# EAGLE board Mem Switch V1.1 (EAGLE 9.6.2), part 1 of 2
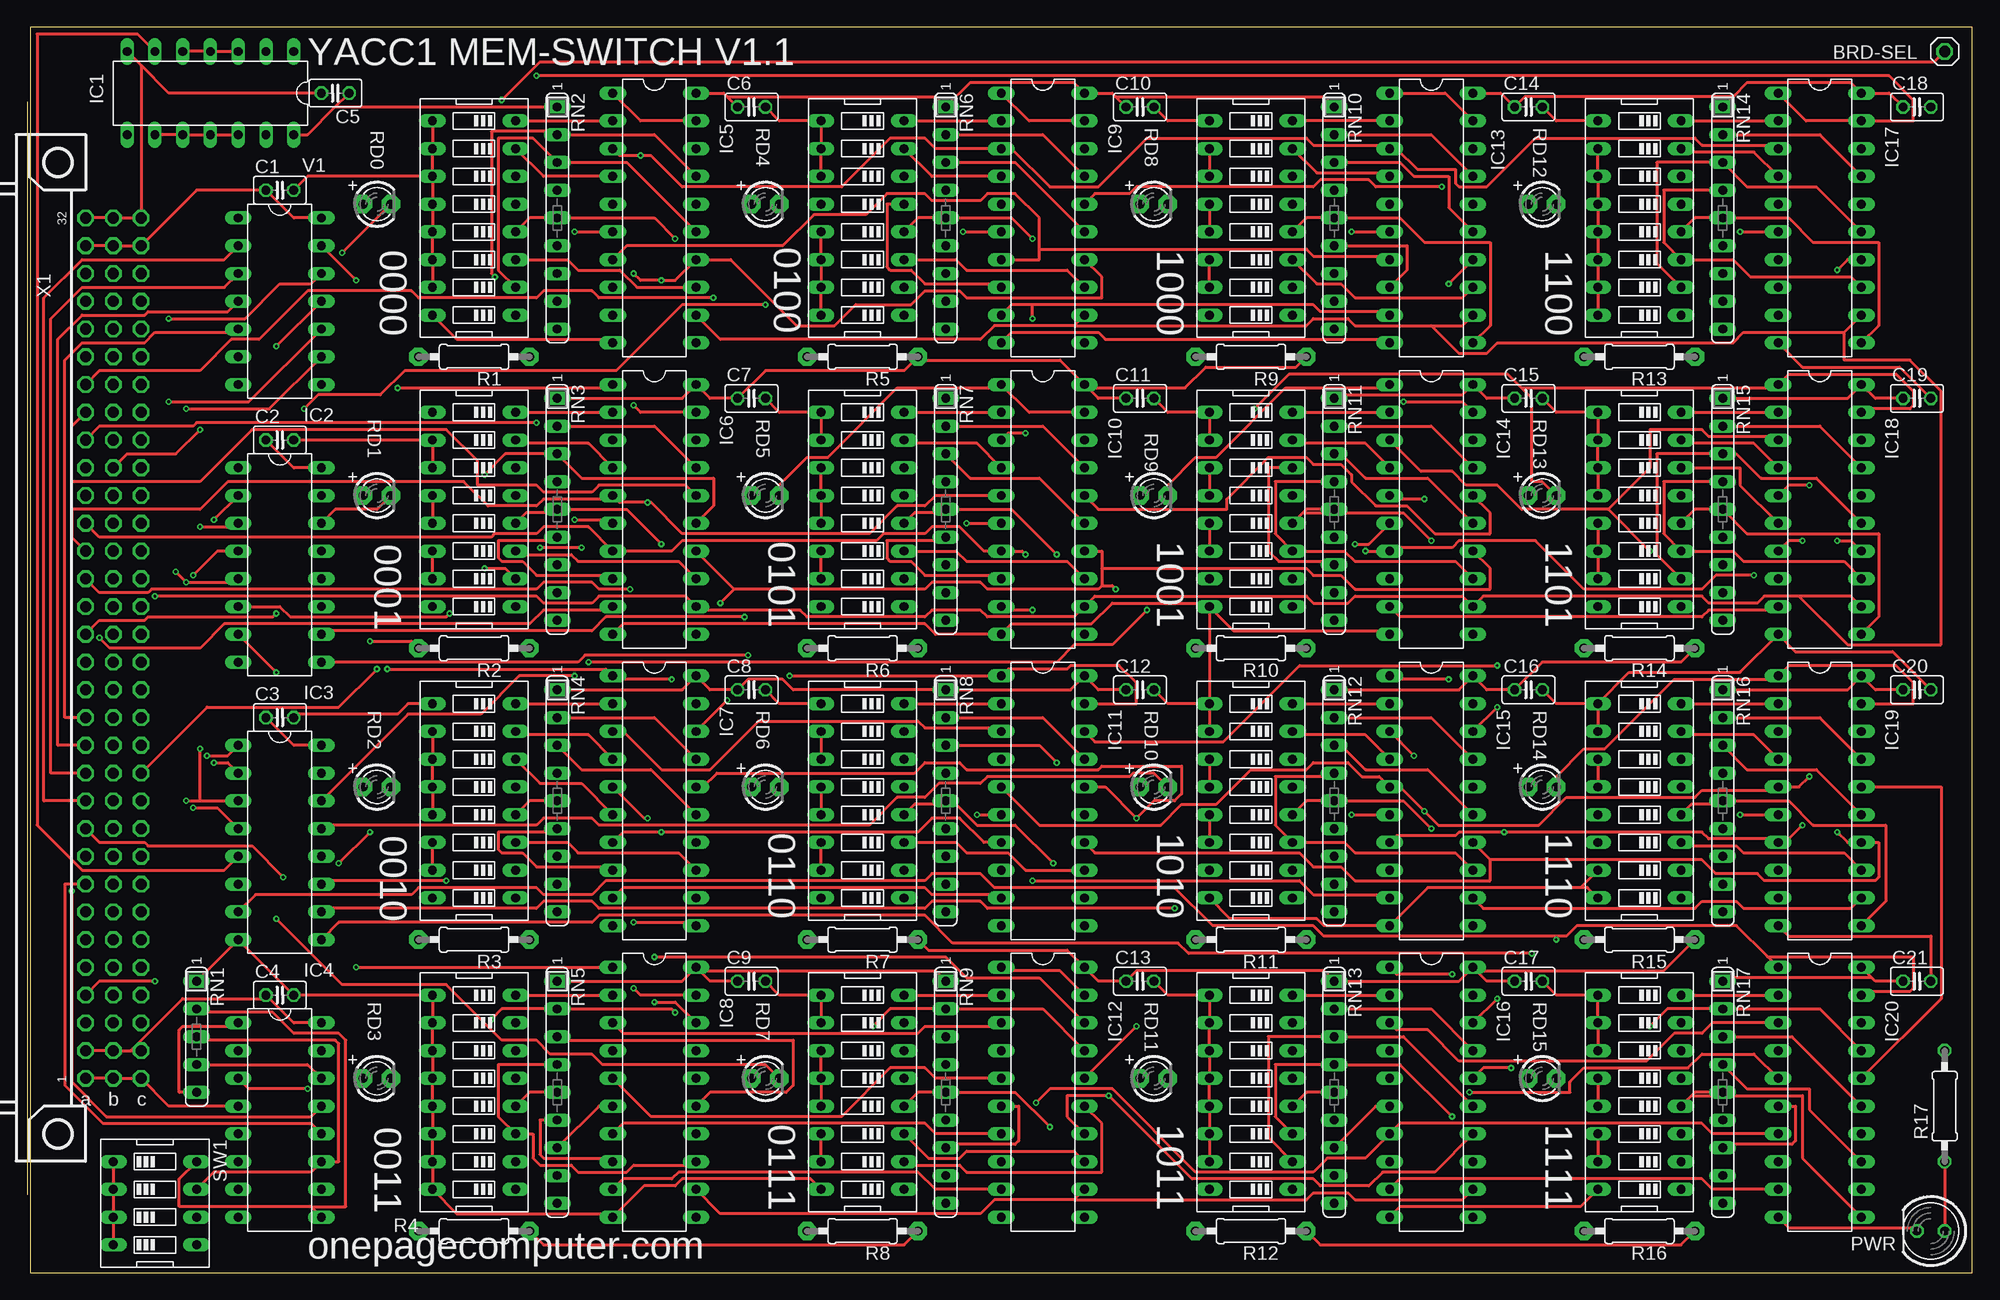
[diagram p3: board, top side]
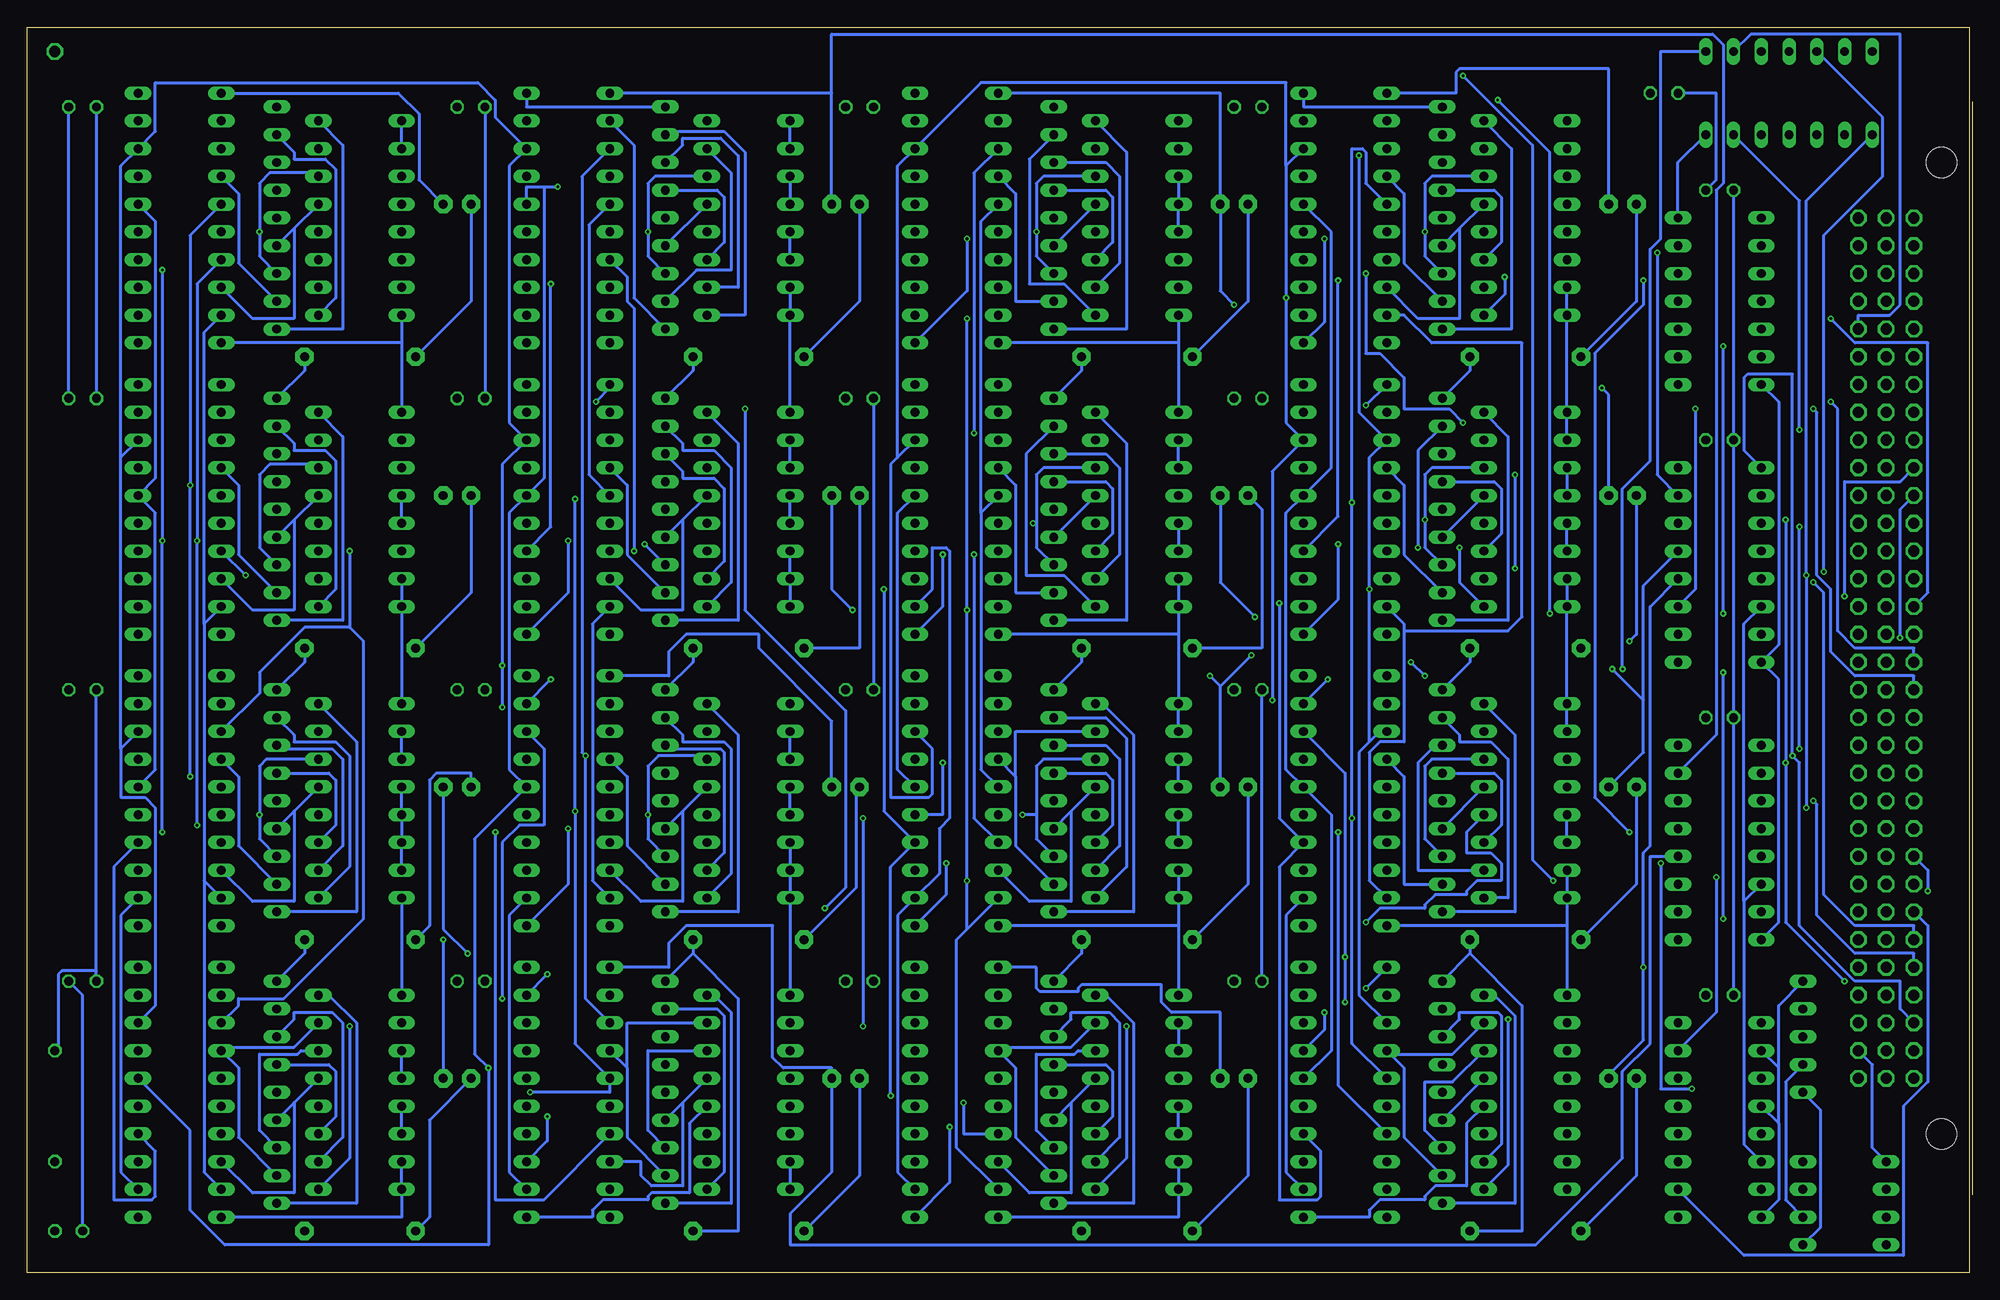
[diagram p4: board, bottom side, seen from below]

Size 177.78 x 113.97 mm. Coordinates in mm from the lower left corner, seen from the top.
Outline: 0,0 177.78,0 177.78,113.97 0,113.97 0,0
Copper layers (1*16): Top 0.035559375mm / dielectric 1.6mm / Bottom 0.035559375mm
Design rules "oshpark-2layer-auto-routing": minimum track width 10mil, minimum drill 10mil, track to track 10mil, track to pad 8mil, pad to pad 8mil, via to via 8mil, smd to smd 6mil, copper to edge 15mil, drill to drill 6mil, minimum pad ring 6mil, minimum via ring 6mil, stop-mask expansion 2.5mil, vias tented up to drill 0mil, thermal gap 10mil
Net classes: 1 GND: width 1 mm; 2 5V: width 1 mm

## Footprints (pad centres in the part's own frame; a part is rotated, then mirrored left to right if it is on the bottom)
EDG-08 = drill 0.813 long: 1 -8.89,-3.81; 2 -6.35,-3.81; 3 -3.81,-3.81; 4 -1.27,-3.81; 5 1.27,-3.81; 6 3.81,-3.81; 7 6.35,-3.81; 8 8.89,-3.81; 9 8.89,3.81; 10 6.35,3.81; 11 3.81,3.81; 12 1.27,3.81; 13 -1.27,3.81; 14 -3.81,3.81; 15 -6.35,3.81; 16 -8.89,3.81
1X01 = drill 1.016 octagon: 1 0,0
C025-025X050 = drill 0.813 octagon: 1 -1.27,0; 2 1.27,0
DIL14 = drill 0.813 long: 1 -7.62,-3.81; 2 -5.08,-3.81; 3 -2.54,-3.81; 4 0,-3.81; 5 2.54,-3.81; 6 5.08,-3.81; 7 7.62,-3.81; 8 7.62,3.81; 9 5.08,3.81; 10 2.54,3.81; 11 0,3.81; 12 -2.54,3.81; 13 -5.08,3.81; 14 -7.62,3.81
DIL16 = drill 0.813 long: 1 -8.89,-3.81; 2 -6.35,-3.81; 3 -3.81,-3.81; 4 -1.27,-3.81; 5 1.27,-3.81; 6 3.81,-3.81; 7 6.35,-3.81; 8 8.89,-3.81; 9 8.89,3.81; 10 6.35,3.81; 11 3.81,3.81; 12 1.27,3.81; 13 -1.27,3.81; 14 -3.81,3.81; 15 -6.35,3.81; 16 -8.89,3.81
DIL20 = drill 0.813 long: 1 -11.43,-3.81; 2 -8.89,-3.81; 3 -6.35,-3.81; 4 -3.81,-3.81; 5 -1.27,-3.81; 6 1.27,-3.81; 7 3.81,-3.81; 8 6.35,-3.81; 9 8.89,-3.81; 10 11.43,-3.81; 11 11.43,3.81; 12 8.89,3.81; 13 6.35,3.81; 14 3.81,3.81; 15 1.27,3.81; 16 -1.27,3.81; 17 -3.81,3.81; 18 -6.35,3.81; 19 -8.89,3.81; 20 -11.43,3.81
LED5MM = drill 0.813 octagon: A -1.27,0; K 1.27,0
0207/10 = drill 0.813 pad 1.676 octagon: 1 -5.08,0; 2 5.08,0
0207/10' = drill 0.813 octagon: 1 -5.08,0; 2 5.08,0
LED3MM = drill 0.813 pad 1.676 octagon: A -1.27,0; K 1.27,0
SIL5 = drill 0.813 long: 1 -5.08,0; 2 -2.54,0; 3 0,0; 4 2.54,0; 5 5.08,0
SIL9 = drill 0.813 long: 1 -10.16,0; 2 -7.62,0; 3 -5.08,0; 4 -2.54,0; 5 0,0; 6 2.54,0; 7 5.08,0; 8 7.62,0; 9 10.16,0
EDG-04 = drill 0.813 long: 1 -3.81,-3.81; 2 -1.27,-3.81; 3 1.27,-3.81; 4 3.81,-3.81; 5 3.81,3.81; 6 1.27,3.81; 7 -1.27,3.81; 8 -3.81,3.81
FABC96R = drill 1.016 octagon: A1 -2.54,39.37; A2 -2.54,36.83; A3 -2.54,34.29; A4 -2.54,31.75; A5 -2.54,29.21; A6 -2.54,26.67; A7 -2.54,24.13; A8 -2.54,21.59; A9 -2.54,19.05; A10 -2.54,16.51; A11 -2.54,13.97; A12 -2.54,11.43; A13 -2.54,8.89; A14 -2.54,6.35; A15 -2.54,3.81; A16 -2.54,1.27; A17 -2.54,-1.27; A18 -2.54,-3.81; A19 -2.54,-6.35; A20 -2.54,-8.89; A21 -2.54,-11.43; A22 -2.54,-13.97; A23 -2.54,-16.51; A24 -2.54,-19.05; A25 -2.54,-21.59; A26 -2.54,-24.13; A27 -2.54,-26.67; A28 -2.54,-29.21; A29 -2.54,-31.75; A30 -2.54,-34.29; A31 -2.54,-36.83; A32 -2.54,-39.37; B1 -5.08,39.37; B2 -5.08,36.83; B3 -5.08,34.29; B4 -5.08,31.75; B5 -5.08,29.21; B6 -5.08,26.67; B7 -5.08,24.13; B8 -5.08,21.59; B9 -5.08,19.05; B10 -5.08,16.51; B11 -5.08,13.97; B12 -5.08,11.43; B13 -5.08,8.89; B14 -5.08,6.35; B15 -5.08,3.81; B16 -5.08,1.27; B17 -5.08,-1.27; B18 -5.08,-3.81; B19 -5.08,-6.35; B20 -5.08,-8.89; B21 -5.08,-11.43; B22 -5.08,-13.97; B23 -5.08,-16.51; B24 -5.08,-19.05; B25 -5.08,-21.59; B26 -5.08,-24.13; B27 -5.08,-26.67; B28 -5.08,-29.21; B29 -5.08,-31.75; B30 -5.08,-34.29; B31 -5.08,-36.83; B32 -5.08,-39.37; C1 -7.62,39.37; C2 -7.62,36.83; C3 -7.62,34.29; C4 -7.62,31.75; C5 -7.62,29.21; C6 -7.62,26.67; C7 -7.62,24.13; C8 -7.62,21.59; C9 -7.62,19.05; C10 -7.62,16.51; C11 -7.62,13.97; C12 -7.62,11.43; C13 -7.62,8.89; C14 -7.62,6.35; C15 -7.62,3.81; C16 -7.62,1.27; C17 -7.62,-1.27; C18 -7.62,-3.81; C19 -7.62,-6.35; C20 -7.62,-8.89; C21 -7.62,-11.43; C22 -7.62,-13.97; C23 -7.62,-16.51; C24 -7.62,-19.05; C25 -7.62,-21.59; C26 -7.62,-24.13; C27 -7.62,-26.67; C28 -7.62,-29.21; C29 -7.62,-31.75; C30 -7.62,-34.29; C31 -7.62,-36.83; C32 -7.62,-39.37 | hole 2.794: 0,-44.456; 0,44.456

## Placement (x,y rotation side)
0000  [EDG-08]  40.64,96.52 90 top
0001  [EDG-08]  40.64,69.85 90 top
0010  [EDG-08]  40.64,43.18 90 top
0011  [EDG-08]  40.64,16.51 90 top
0100  [EDG-08]  76.2,96.52 90 top
0101  [EDG-08]  76.2,69.85 90 top
0110  [EDG-08]  76.2,43.18 90 top
0111  [EDG-08]  76.2,16.51 90 top
1000  [EDG-08]  111.76,96.52 90 top
1001  [EDG-08]  111.76,69.85 90 top
1010  [EDG-08]  111.76,43.18 90 top
1011  [EDG-08]  111.76,16.51 90 top
1100  [EDG-08]  147.32,96.52 90 top
1101  [EDG-08]  147.32,69.85 90 top
1110  [EDG-08]  147.32,43.18 90 top
1111  [EDG-08]  147.32,16.51 90 top
BRD-SEL  PINHD-1X1  [1X01]  175.26,111.76 0 top
C1  [C025-025X050]  22.86,99.06 0 top
C2  [C025-025X050]  22.86,76.2 0 top
C3  [C025-025X050]  22.86,50.8 0 top
C4  [C025-025X050]  22.86,25.4 0 top
C5  [C025-025X050]  27.94,107.95 180 top
C6  [C025-025X050]  66.04,106.68 0 top
C7  [C025-025X050]  66.04,80.01 0 top
C8  [C025-025X050]  66.04,53.34 0 top
C9  [C025-025X050]  66.04,26.67 0 top
C10  [C025-025X050]  101.6,106.68 0 top
C11  [C025-025X050]  101.6,80.01 0 top
C12  [C025-025X050]  101.6,53.34 0 top
C13  [C025-025X050]  101.6,26.67 0 top
C14  [C025-025X050]  137.16,106.68 0 top
C15  [C025-025X050]  137.16,80.01 0 top
C16  [C025-025X050]  137.16,53.34 0 top
C17  [C025-025X050]  137.16,26.67 0 top
C18  [C025-025X050]  172.72,106.68 0 top
C19  [C025-025X050]  172.72,80.01 0 top
C20  [C025-025X050]  172.72,53.34 0 top
C21  [C025-025X050]  172.72,26.67 0 top
IC1  74ALS27N  [DIL14]  16.51,107.95 180 top
IC2  74LS138N  [DIL16]  22.86,64.77 270 top
IC3  74LS138N  [DIL16]  22.86,39.37 270 top
IC4  74LS85N  [DIL16]  22.86,13.97 270 top
IC5  74LS244N  [DIL20]  57.15,96.52 270 top
IC6  74LS244N  [DIL20]  57.15,69.85 270 top
IC7  74LS244N  [DIL20]  57.15,43.18 270 top
IC8  74LS244N  [DIL20]  57.15,16.51 270 top
IC9  74LS244N  [DIL20]  92.71,96.52 270 top
IC10  74LS244N  [DIL20]  92.71,69.85 270 top
IC11  74LS244N  [DIL20]  92.71,43.18 270 top
IC12  74LS244N  [DIL20]  92.71,16.51 270 top
IC13  74LS244N  [DIL20]  128.27,96.52 270 top
IC14  74LS244N  [DIL20]  128.27,69.85 270 top
IC15  74LS244N  [DIL20]  128.27,43.18 270 top
IC16  74LS244N  [DIL20]  128.27,16.51 270 top
IC17  74LS244N  [DIL20]  163.83,96.52 270 top
IC18  74LS244N  [DIL20]  163.83,69.85 270 top
IC19  74LS244N  [DIL20]  163.83,43.18 270 top
IC20  74LS244N  [DIL20]  163.83,16.51 270 top
PWR  [LED5MM]  173.99,3.81 180 top
R1  [0207/10]  40.64,83.82 180 top
R2  [0207/10]  40.64,57.15 180 top
R3  [0207/10]  40.64,30.48 180 top
R4  [0207/10]  40.64,3.81 180 top
R5  [0207/10]  76.2,83.82 180 top
R6  [0207/10]  76.2,57.15 180 top
R7  [0207/10]  76.2,30.48 180 top
R8  [0207/10]  76.2,3.81 180 top
R9  [0207/10]  111.76,83.82 180 top
R10  [0207/10]  111.76,57.15 180 top
R11  [0207/10]  111.76,30.48 180 top
R12  [0207/10]  111.76,3.81 180 top
R13  [0207/10]  147.32,83.82 180 top
R14  [0207/10]  147.32,57.15 180 top
R15  [0207/10]  147.32,30.48 180 top
R16  [0207/10]  147.32,3.81 180 top
R17  330  [0207/10']  175.26,15.24 90 top
RD0  [LED3MM]  31.75,97.79 0 top
RD1  [LED3MM]  31.75,71.12 0 top
RD2  [LED3MM]  31.75,44.45 0 top
RD3  [LED3MM]  31.75,17.78 0 top
RD4  [LED3MM]  67.31,97.79 0 top
RD5  [LED3MM]  67.31,71.12 0 top
RD6  [LED3MM]  67.31,44.45 0 top
RD7  [LED3MM]  67.31,17.78 0 top
RD8  [LED3MM]  102.87,97.79 0 top
RD9  [LED3MM]  102.87,71.12 0 top
RD10  [LED3MM]  102.87,44.45 0 top
RD11  [LED3MM]  102.87,17.78 0 top
RD12  [LED3MM]  138.43,97.79 0 top
RD13  [LED3MM]  138.43,71.12 0 top
RD14  [LED3MM]  138.43,44.45 0 top
RD15  [LED3MM]  138.43,17.78 0 top
RN1  [SIL5]  15.24,21.59 270 top
RN2  [SIL9]  48.26,96.52 270 top
RN3  [SIL9]  48.26,69.85 270 top
RN4  [SIL9]  48.26,43.18 270 top
RN5  [SIL9]  48.26,16.51 270 top
RN6  [SIL9]  83.82,96.52 270 top
RN7  [SIL9]  83.82,69.85 270 top
RN8  [SIL9]  83.82,43.18 270 top
RN9  [SIL9]  83.82,16.51 270 top
RN10  [SIL9]  119.38,96.52 270 top
RN11  [SIL9]  119.38,69.85 270 top
RN12  [SIL9]  119.38,43.18 270 top
RN13  [SIL9]  119.38,16.51 270 top
RN14  [SIL9]  154.94,96.52 270 top
RN15  [SIL9]  154.94,69.85 270 top
RN16  [SIL9]  154.94,43.18 270 top
RN17  [SIL9]  154.94,16.51 270 top
SW1  [EDG-04]  11.43,6.35 270 top
V1  744078N  [DIL14]  22.86,88.9 270 top
X1  FABC96R  [FABC96R]  2.54,57.15 180 top